# EasyEDA Pro project ProProject_gps打窝船_2025-04-29.epro, schematic Schematic1
Board Name: 船主控; Create Date: 2025-03-07; Page Name: P1; Project Name: gps打窝船; Schematic Name: Schematic1; Update Date: 2025-04-25; Company: 嘉立创EDA; Page Size: A4; Version: V1.0
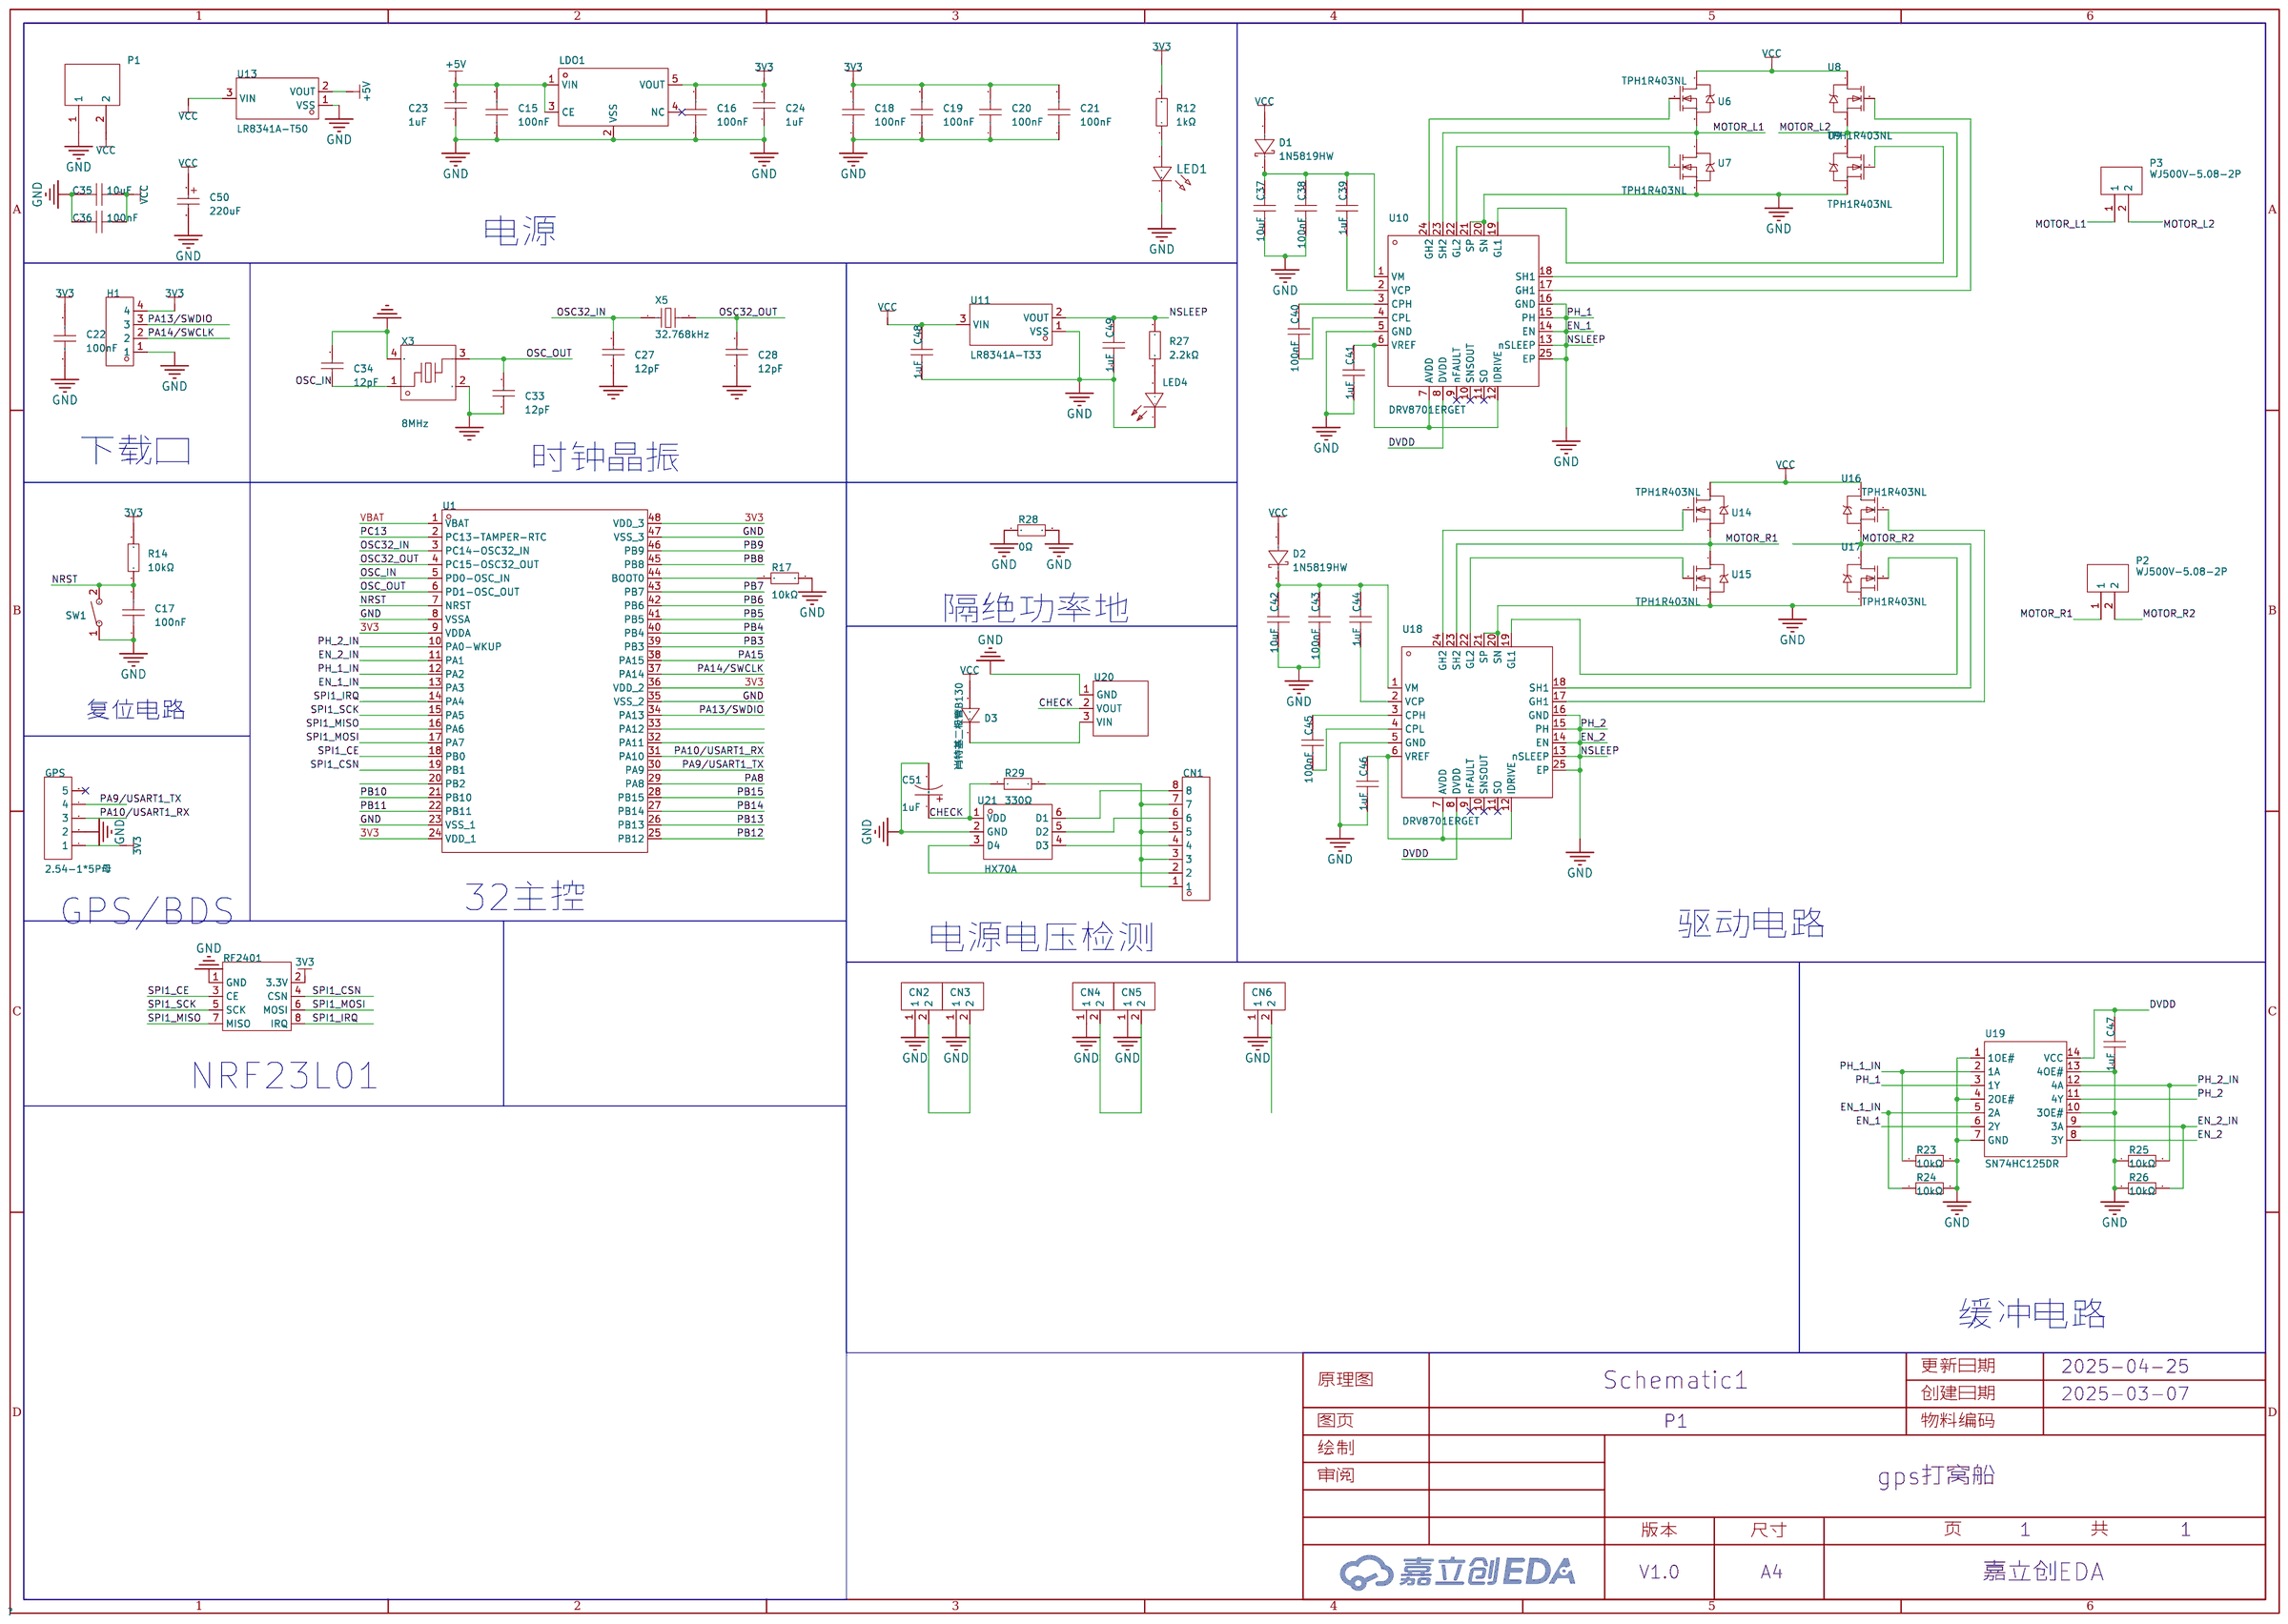
[diagram p1: schematic sheet]

## Parts
C15  100nF  [R0402]
C16  100nF  [R0402]
C17  100nF  [R0402]
C18  100nF  [R0402]
C19  100nF  [R0402]
C20  100nF  [R0402]
C21  100nF  [R0402]
C22  100nF  [R0402]
C23  1uF  [R0402]
C24  1uF  [R0402]
C27  12pF  [R0402]
C28  12pF  [R0402]
C33  12pF  [R0402]
C34  12pF  [R0402]
C35  10uF  [C0603]
C36  100nF  [C0603]
C37  10uF  [C0603]
C38  100nF  [C0603]
C39  1uF  [C0603]
C40  100nF  [C0603]
C41  1uF  [C0603]
C42  10uF  [C0603]
C43  100nF  [C0603]
C44  1uF  [C0603]
C45  100nF  [C0603]
C46  1uF  [C0603]
C47  1uF  [C0603]
C48  1uF  [C0603]
C49  1uF  [C0603]
C50  220uF  [CASE-B_3528]
C51  1uF  [CAP-SMD_L3.2-W1.6-RD]
CN1  ZX-XH2.54-8PZZ  [CONN-TH_8P-P2.50-XH2.54-8P]
CN2  ZX-XH2.54-2PZZ  [CONN-TH_2P-P2.50_HX25003-2A]
CN3  ZX-XH2.54-2PZZ  [CONN-TH_2P-P2.50_HX25003-2A]
CN4  ZX-XH2.54-2PZZ  [CONN-TH_2P-P2.50_HX25003-2A]
CN5  ZX-XH2.54-2PZZ  [CONN-TH_2P-P2.50_HX25003-2A]
CN6  ZX-XH2.54-2PZZ  [CONN-TH_2P-P2.50_HX25003-2A]
D1  1N5819HW  [SOD-123_L2.7-W1.6-LS3.8-RD]
D2  1N5819HW  [SOD-123_L2.7-W1.6-LS3.8-RD]
D3  肖特基二极管B130  [SOD-123_L2.7-W1.7-LS3.8-RD]
GPS  2.54-1*5P母  [HDR-TH_5P-P2.54-V-F]
H1  -  [HDR-TH_4P-P2.54-V-M]
LDO1  ME6211C33M5G-N  [SOT-23-5_L3.0-W1.7-P0.95-LS2.8-BL]
LED1  -  [LED_0603]
LED4  LTST-C191KSKT  [LED0603-RD-YELLOW]
P1  WJ128V-5.0-2P  [CONN-TH_2P-P5.00_WJ128V-5.0-2P]
P2  WJ500V-5.08-2P  [CONN-TH_2P-P5.00_WJ500V-5.08-2P]
P3  WJ500V-5.08-2P  [CONN-TH_2P-P5.00_WJ500V-5.08-2P]
R12  1kΩ  [R0402]
R14  10kΩ  [R0402]
R17  10kΩ  [R0402]
R23  10kΩ  [R0603]
R24  10kΩ  [R0603]
R25  10kΩ  [R0603]
R26  10kΩ  [R0603]
R27  2.2kΩ  [R0603]
R28  0Ω  [R0603]
R29  330Ω  [R0603]
RF2401  PZ254V-12-8P  [HDR-TH_8P-P2.54-V-M-R2-C4-S2.54]
SW1  TS-1101-B-W  [KEY-SMD_2P-L6.0-W3.6-P7.4-LS8.0-L]
U1  STM32F103C8T6  [LQFP-48_L7.0-W7.0-P0.50-LS9.0-BL]
U6  TPH1R403NL  [PDFN-8_L3.1-W3.0-P0.65-LS3.3-BL-G12P03D3]
U7  TPH1R403NL  [PDFN-8_L3.1-W3.0-P0.65-LS3.3-BL-G12P03D3]
U8  TPH1R403NL  [PDFN-8_L3.1-W3.0-P0.65-LS3.3-BL-G12P03D3]
U9  TPH1R403NL  [PDFN-8_L3.1-W3.0-P0.65-LS3.3-BL-G12P03D3]
U10  DRV8701ERGET  [VQFN-24_L4.0-W4.0-P0.50-BL-EP2.5]
U11  LR8341A-T33  [SOT-23-3L_L2.9-W1.6-P1.90-LS2.8-BL]
U13  LR8341A-T50  [SOT-23-3L_L2.9-W1.6-P1.90-LS2.8-BL]
U14  TPH1R403NL  [PDFN-8_L3.1-W3.0-P0.65-LS3.3-BL-G12P03D3]
U15  TPH1R403NL  [PDFN-8_L3.1-W3.0-P0.65-LS3.3-BL-G12P03D3]
U16  TPH1R403NL  [PDFN-8_L3.1-W3.0-P0.65-LS3.3-BL-G12P03D3]
U17  TPH1R403NL  [PDFN-8_L3.1-W3.0-P0.65-LS3.3-BL-G12P03D3]
U18  DRV8701ERGET  [VQFN-24_L4.0-W4.0-P0.50-BL-EP2.5]
U19  SN74HC125DR  [SOIC-14_L8.7-W3.9-P1.27-LS6.0-BL]
U20  MST52L30BTE  [SOT-23-3_L2.9-W1.6-P1.90-LS2.8-BR]
U21  HX70A  [SOT-23-6_L2.9-W1.6-P0.95-LS2.8-BL]
X3  8MHz  [CRYSTAL-SMD_4P-L3.2-W2.5-BL-1]
X5  32.768kHz  [OSC-SMD_L3.2-W1.5]

## Library data of the parts
C15-C22 = GRM155R71H104KE14D: 容值:100nF;精度:±10%;额定电压:50V;材质(温度系数):X7R;; LCSC Part Name: 100nF ±10% 50V; Supplier Part: C77020; Manufacturer: muRata(村田); Supplier Footprint: 0402; JLCPCB Part Class: 扩展库; Datasheet: https://atta.szlcsc.com/upload/public/pdf/source/20180326/C77020_39BD49C951FF1AF0DB1F1FAC5AC1E401.pdf; Supplier: LCSC; Tolerance: ±10%; Voltage Rated: 50V; Temperature Coefficient: X7R
C23 C24 = CL05A105KP5NNNC: 容值:1uF;精度:±10%;额定电压:10V;材质(温度系数):X5R;; LCSC Part Name: 1uF ±10% 10V; Supplier Part: C14445; Manufacturer: SAMSUNG(三星); Supplier Footprint: 0402; JLCPCB Part Class: 扩展库; Datasheet: https://atta.szlcsc.com/upload/public/pdf/source/20160218/1457707763339.pdf; Supplier: LCSC; Tolerance: ±10%; Voltage Rated: 10V; Temperature Coefficient: X5R
C27 C28 C33 C34 = 0402CG120J500NT: 容值:12pF;精度:±5%;额定电压:50V;材质(温度系数):C0G;; LCSC Part Name: 12pF ±5% 50V; Supplier Part: C1547; Manufacturer: FH(风华); Supplier Footprint: 0402; JLCPCB Part Class: 基础库; Datasheet: https://atta.szlcsc.com/upload/public/pdf/source/20200305/C486355_26A10D38EF8C2A5C37091D0039909270.pdf; Supplier: LCSC; Tolerance: ±5%; Voltage Rated: 50V; Temperature Coefficient: C0G
C35 C37 C42 = CGA0603X5R106K100JT: 容值:10uF;精度:±10%;额定电压:10V;温度系数:X5R;; LCSC Part Name: 10uF ±10% 10V; Supplier Part: C6119842; Manufacturer: HRE(芯声); Supplier Footprint: 0603; Supplier: LCSC; Tolerance: ±10%; Voltage Rating: 10V; Temperature Coefficient: X5R
C36 C38 C40 C43 C45 = CGA0603X7R104K500JT: 容值:100nF;精度:±10%;额定电压:50V;温度系数:X7R;; LCSC Part Name: 100nF ±10% 50V; Supplier Part: C6119867; Manufacturer: HRE(芯声); Supplier Footprint: 0603; Datasheet: https://atta.szlcsc.com/upload/public/pdf/source/20250103/C44077DA9E7B3EFAE02F22B6D3D1CBC9.pdf; Supplier: LCSC; Tolerance: ±10%; Voltage Rating: 50V; Temperature Coefficient: X7R
C39 C41 C44 C46-C49 = CGA0603X5R105K500JT: 容值:1uF;精度:±10%;额定电压:50V;温度系数:X5R;; LCSC Part Name: 1uF ±10% 50V; Supplier Part: C6119852; Manufacturer: HRE(芯声); Supplier Footprint: 0603; Supplier: LCSC; Tolerance: ±10%; Voltage Rating: 50V; Temperature Coefficient: X5R
C50 = TLJB227M006R0500: 容值:220uF;精度:±20%;额定电压:6.3V;等效串联电阻:500mΩ@100kHz;; LCSC Part Name: 220uF ±20% 6.3V; Supplier Part: C30242; Manufacturer: Kyocera AVX; Supplier Footprint: CASE-B-3528-21(mm); Datasheet: https://atta.szlcsc.com/upload/public/pdf/source/20181016/C313517_95E099C94D57B8A6005DAF15C3058A23.pdf; Supplier: LCSC; Tolerance: ±20%; Rated Voltage: 6.3V; Equivalent Series Resistance(ESR): 500mΩ@100kHz; Operating Temperature: -55℃~+125℃
C51 = CA45-A-16V-1uF-K: 容值:1uF;精度:±10%;额定电压:16V;等效串联电阻:10Ω@100kHz;; LCSC Part Name: 1uF ±10% 16V; Supplier Part: C140386; Manufacturer: CEC(振华新云); Supplier Footprint: CASE-A-3216; JLCPCB Part Class: 扩展库; Datasheet: https://atta.szlcsc.com/upload/public/pdf/source/20171113/C140386_15105612823691115749.pdf; Supplier: LCSC; Tolerance: ±10%; Rated Voltage: 16V; Equivalent Series Resistance(ESR): 10Ω@100kHz; Operating Temperature: -55℃~+125℃
CN1 = ZX-XH2.54-8PZZ: 插针结构:1x8P;间距:2.5mm;安装方式:直插;参考系列:XH;总PIN数:8P;排数:1;每排PIN数:8;行距:-;额定电流:3A;触头材质:黄铜;触头镀层:锡;工作温度范围:-25℃~+85℃;; LCSC Part Name: 1x8P 间距:2.5mm 直插 系列:XH; Supplier Part: C7429638; Manufacturer: Megastar(兆星); Supplier Footprint: 插件,P=2.5mm; Datasheet: https://atta.szlcsc.com/upload/public/pdf/source/20230619/688603DEA58996C00B1F33C46797D2C3.pdf; Supplier: LCSC; Pins Structure: 1x8P; Pitch: 2.5mm; Mounting Type: 直插; Reference Series: XH; Number of Pins: 8P; Number of Rows: 1; Number of PINs Per Row: 8; Rated Current: 3A; Contact Material: 黄铜; Contact Plating: 锡; Operating Temperature: -25℃~+85℃; Rated Voltage (Max): 250V; Plastic Material: PA66; Flame Retardant Rating: UL94V-0; Color: 白色; Z-Height of the Board: 7mm; X-Length of Bottom Edge on Board (Spacing Line): 22.5mm; Y-Width of Bottom Edge on Board: 5.9mm
CN2-CN6 = ZX-XH2.54-2PZZ: 插针结构:1x2P;间距:2.5mm;安装方式:直插;参考系列:XH;总PIN数:2P;排数:1;每排PIN数:2;行距:-;额定电流:3A;触头材质:黄铜;触头镀层:锡;工作温度范围:-25℃~+85℃;; LCSC Part Name: 1x2P 间距:2.5mm 直插 系列:XH; Supplier Part: C7429632; Manufacturer: Megastar(兆星); Supplier Footprint: 插件,P=2.5mm; Datasheet: https://atta.szlcsc.com/upload/public/pdf/source/20230619/19BA6947230AA44A04D3EDD65E618FD0.pdf; Supplier: LCSC; Pins Structure: 1x2P; Pitch: 2.5mm; Mounting Type: 直插; Reference Series: XH; Number of Pins: 2P; Number of Rows: 1; Number of PINs Per Row: 2; Rated Current: 3A; Contact Material: 黄铜; Contact Plating: 锡; Operating Temperature: -25℃~+85℃; Rated Voltage (Max): 250V; Plastic Material: PA66; Flame Retardant Rating: UL94V-0; Color: 白色; Z-Height of the Board: 7mm; X-Length of Bottom Edge on Board (Spacing Line): 7.5mm; Y-Width of Bottom Edge on Board: 5.9mm
D1 D2 = 1N5819HW_C41431974: 正向压降(Vf):580mV@1.0A;直流反向耐压(Vr):40V;整流电流:1A;; Supplier Part: C41431974; Manufacturer: GOODWORK(固得沃克); Supplier Footprint: SOD-123; Datasheet: https://atta.szlcsc.com/upload/public/pdf/source/20241016/F9575ED4EB339D9C6D56946D8A9F6336.pdf; Supplier: LCSC; Voltage - Forward(Vf@If): 580mV@1.0A; Voltage - DC Reverse(Vr): 40V; Current - Rectified: 1A; Reverse Leakage Current (Ir): 50uA@40V
D3 = 肖特基二极管B130: Supplier Part: C9900019643; Supplier Footprint: D1005; JLCPCB Part Class: 扩展库; Supplier: LCSC
GPS = 2.54-1*5P母: 插孔结构:1x5P;间距:2.54mm;行距:-;安装类型:直插;排数:单排;总孔位数:5P;塑高:-;触头材质:-;触头镀层:-;; LCSC Part Name: 间距:2.54mm 1x5P 直插; Supplier Part: C50950; Manufacturer: BOOMELE(博穆精密); Supplier Footprint: 插件,P=2.54mm; Datasheet: https://atta.szlcsc.com/upload/public/pdf/source/20210301/C2718488_F4427B881E42CAA8DDB0B1C12B3A522C.pdf; Supplier: LCSC; Holes Structure: 1x5P; Pitch: 2.54mm; Mounting Type: 直插; Number of Rows: 单排; Number of Holes: 5P
H1 = HDR-M_2.54_1x4P: Supplier Part: C2935929; Supplier Footprint: 插件
LDO1 = ME6211C33M5G-N: 输出类型:固定;工作电压:6V;输出电压:3.3V;输出电流:500mA;电源纹波抑制比(PSRR):70dB@(1kHz)；62dB@(10kHz);输出极性:正极;; LCSC Part Name: 输入6V 输出3.3V 500mA; Supplier Part: C82942; Manufacturer: MICRONE(南京微盟); Supplier Footprint: SOT-23-5; JLCPCB Part Class: 扩展库; Datasheet: https://atta.szlcsc.com/upload/public/pdf/source/20170918/C82942_1505727073070976520.pdf; Supplier: LCSC; Output Type: 固定; Voltage - Supply: 6V; Output Voltage: 3.3V; Output Current: 500mA; Power Supply Rejection Ratio (PSRR): 70dB@(1kHz)；62dB@(10kHz); Voltage Dropout: 260mV@(200mA); Features: 短路保护(SCP)；低ESR；过流保护(OCP)；带使能; Output Configuration: 正极; Number of Outputs: 1; Output Polarity: 正; Maximum Input Voltage: 6V; Dropout Voltage: 260mV@(200mA)
LED1 = LED_0603-R: Supplier Footprint: 0603; Supplier Part: C84263
LED4 = LTST-C191KSKT: 发光颜色:黄色;正向电压(VF):2.1V;功率:75mW;正向电流:20mA;主波长:584.5nm~597nm;二极管配置:-;透镜颜色:无色透明透镜;色温:-;发光强度:104mcd;发光角度:130°;载带方式:-;工作温度:-55℃~+85℃;; LCSC Part Name: 黄灯; Supplier Part: C125100; Manufacturer: LITEON(光宝); Supplier Footprint: 0603; Datasheet: https://atta.szlcsc.com/upload/public/pdf/source/20180129/C125100_15171877314981315871.pdf; Supplier: LCSC; Emitted Color: 黄色; Forward Voltage (VF): 2.1V; Power Dissipation: 75mW; Forward Current: 20mA; Dominant Wavelength: 584.5nm~597nm; Peak Wavelength: 588nm; Lens Color: 无色透明透镜; Luminous Intensity: 104mcd; Viewing Angle: 130°; Operating Temperature: -55℃~+85℃
P1 = WJ128V-5.0-2P: 结构:1x2P;间距:5mm;颜色:绿色;安装方式:直插;额定电流:20A;额定电压:250V;排数:1;线规 - AWG:12~22;线规 - 平方毫米:2.5;每排PIN数:2;工作温度范围:-40℃~+105℃;; LCSC Part Name: 5mm 1x2P 排数:1 每排P数:2 直插; Supplier Part: C8269; Manufacturer: KANGNEX(康奈克斯电气); Supplier Footprint: 插件,P=5mm; Datasheet: https://atta.szlcsc.com/upload/public/pdf/source/20191225/C8269_1FF44D6D2E83DB14A7CA266A410FD9AD.pdf; Supplier: LCSC; Structure: 1x2P; Pitch: 5mm; Color: 绿色; Mounting Style: 直插; Current Rating (Max): 20A; Voltage Rating (Max): 250V; Number of Pins: 2P; Number of Rows: 1; Wire Gauge - AWG: 12~22; Wire Gauge - mm2: 2.5; Number of PINs Per Row: 2; Operating Temperature Range: -40℃~+105℃
P2 P3 = WJ500V-5.08-2P: 结构:1x2P;间距:5.08mm;颜色:绿色;安装方式:直插;额定电流:18A;额定电压:250V;排数:1;线规 - AWG:14~30;线规 - 平方毫米:2.5;每排PIN数:2;触头材质:-;触头镀层:-;工作温度范围:-40℃~+105℃;焊接温度(最大值):-;; LCSC Part Name: 1x2P 5.08mm 直插 排数:1 每排P数:2; Supplier Part: C8465; Manufacturer: KANGNEX(康奈克斯电气); Supplier Footprint: 插件,P=5.08mm; Datasheet: https://atta.szlcsc.com/upload/public/pdf/source/20191225/C8465_02D34CE5B5B4A53DF5891601D97FA9F4.pdf; Supplier: LCSC; Structure: 1x2P; Pitch: 5.08mm; Color: 绿色; Mounting Style: 直插; Current Rating (Max): 18A; Voltage Rating (Max): 250V; Number of Pins: 2P; Number of Rows: 1; Wire Gauge - AWG: 14~30; Wire Gauge - mm2: 2.5; Number of PINs Per Row: 2; Operating Temperature Range: -40℃~+105℃; Screw Specification: M2.5
R12 = 0402WGF1001TCE: 电阻类型:厚膜电阻;阻值:1kΩ;精度:±1%;功率:62.5mW;最大工作电压:50V;温度系数:±100ppm/℃;; LCSC Part Name: 1kΩ ±1% 62.5mW 厚膜电阻; Supplier Part: C11702; Manufacturer: UNI-ROYAL(厚声); Supplier Footprint: 0402; JLCPCB Part Class: 基础库; Datasheet: https://atta.szlcsc.com/upload/public/pdf/source/20200306/C422600_1E6D84923E4A46A82E41ADD87F860B5C.pdf; Supplier: LCSC; Type: 厚膜电阻; Tolerance: ±1%; Power(Watts): 62.5mW; Overload Voltage (Max): 50V; Temperature Coefficient: ±100ppm/℃; Operating Temperature Range: -55℃~+155℃
R14 R17 = RC0402FR-0710KL: 电阻类型:厚膜电阻;阻值:10kΩ;精度:±1%;功率:62.5mW;最大工作电压:50V;温度系数:±100ppm/℃;; LCSC Part Name: 厚膜电阻 10kΩ ±1% 62.5mW; Supplier Part: C60490; Manufacturer: YAGEO(国巨); Supplier Footprint: 0402; JLCPCB Part Class: 扩展库; Datasheet: https://atta.szlcsc.com/upload/public/pdf/source/20170925/C131467_1506321478108990263.pdf; Supplier: LCSC; Type: 厚膜电阻; Tolerance: ±1%; Power(Watts): 62.5mW; Overload Voltage (Max): 50V; Temperature Coefficient: ±100ppm/℃; Operating Temperature Range: -55℃~+155℃
R23-R26 = 0603WAF1002T5E: 电阻类型:厚膜电阻;阻值:10kΩ;精度:±1%;功率:100mW;最大工作电压:75V;温度系数:±100ppm/℃;; LCSC Part Name: 厚膜电阻 10kΩ ±1% 100mW; Supplier Part: C25804; Manufacturer: UNI-ROYAL(厚声); Supplier Footprint: 0603; Datasheet: https://atta.szlcsc.com/upload/public/pdf/source/20200306/C422600_1E6D84923E4A46A82E41ADD87F860B5C.pdf; Supplier: LCSC; Type: 厚膜电阻; Tolerance: ±1%; Power(Watts): 100mW; Overload Voltage (Max): 75V; Temperature Coefficient: ±100ppm/℃; Operating Temperature Range: -55℃~+155℃
R27 = 0603WAF2201T5E: 电阻类型:厚膜电阻;阻值:2.2kΩ;精度:±1%;功率:100mW;最大工作电压:75V;温度系数:±100ppm/℃;; LCSC Part Name: 2.2kΩ ±1% 100mW 厚膜电阻; Supplier Part: C4190; Manufacturer: UNI-ROYAL(厚声); Supplier Footprint: 0603; Datasheet: https://atta.szlcsc.com/upload/public/pdf/source/20200306/C422600_1E6D84923E4A46A82E41ADD87F860B5C.pdf; Supplier: LCSC; Type: 厚膜电阻; Tolerance: ±1%; Power(Watts): 100mW; Overload Voltage (Max): 75V; Temperature Coefficient: ±100ppm/℃; Operating Temperature Range: -55℃~+155℃
R28 = 0603WAF0000T5E: 电阻类型:厚膜电阻;阻值:0Ω;精度:±1%;功率:100mW;最大工作电压:75V;; LCSC Part Name: 0Ω ±1% 100mW 厚膜电阻; Supplier Part: C21189; Manufacturer: UNI-ROYAL(厚声); Supplier Footprint: 0603; Datasheet: https://atta.szlcsc.com/upload/public/pdf/source/20200306/C422600_1E6D84923E4A46A82E41ADD87F860B5C.pdf; Supplier: LCSC; Type: 厚膜电阻; Tolerance: ±1%; Power(Watts): 100mW; Overload Voltage (Max): 75V; Operating Temperature Range: -55℃~+155℃
R29 = 0603WAF3300T5E: 电阻类型:厚膜电阻;阻值:330Ω;精度:±1%;功率:100mW;最大工作电压:75V;温度系数:±100ppm/℃;; LCSC Part Name: 330Ω ±1% 100mW 厚膜电阻; Supplier Part: C23138; Manufacturer: UNI-ROYAL(厚声); Supplier Footprint: 0603; JLCPCB Part Class: 基础库; Datasheet: https://atta.szlcsc.com/upload/public/pdf/source/20200306/C422600_1E6D84923E4A46A82E41ADD87F860B5C.pdf; Supplier: LCSC; Type: 厚膜电阻; Tolerance: ±1%; Power(Watts): 100mW; Overload Voltage (Max): 75V; Temperature Coefficient: ±100ppm/℃; Operating Temperature Range: -55℃~+155℃
RF2401 = PZ254V-12-8P: 插针结构:2x4P;间距:2.54mm;行距:2.54mm;圆针/方针:方针;安装方式:直插;排数:双排;总PIN位数:8P;额定电流:-;额定电压:-;配合针长度:6mm;塑高:2.5mm;端接针长度:3mm;触头材质:黄铜;触头镀层:-;工作温度:-40℃~+105℃;颜色:黑色;; LCSC Part Name: 2x4P 间距:2.54mm 方针 直插; Supplier Part: C492421; Manufacturer: XFCN(兴飞); Supplier Footprint: 插件,P=2.54mm; Datasheet: https://atta.szlcsc.com/upload/public/pdf/source/20200309/C492421_DC8A206AF99CD7755BD4A5B0BC48200B.pdf; Supplier: LCSC; Pin Structure: 2x4P; Pitch: 2.54mm; Row Spacing: 2.54mm; Circluar Pins/Square Pins: 方针; Mounting Type: 直插; Number of Rows: 双排; Number of Pins: 8P; Length of Mating Pin: 6mm; Insulation Height: 2.5mm; Length of End Connection Pin: 3mm; Contact Material: 黄铜; Operating Temperature: -40℃~+105℃; Color: 黑色
SW1 = TS-1101-B-W_C500065: 触点电流:50mA;额定电压(DC):12V;绝缘电阻:-;电路结构:单刀单掷;安装方式:立贴;带灯:无;作用力:160gf;机械寿命:5万次;带支架:否;; LCSC Part Name: 6*3.6*2.5mm 立贴 轻触开关; Supplier Part: C500065; Manufacturer: XKB Connectivity(中国星坤); Supplier Footprint: SMD; JLCPCB Part Class: 扩展库; Datasheet: https://atta.szlcsc.com/upload/public/pdf/source/20211011/D0E0CAF534F7B19DDE4CE68748A25BD3.pdf; Supplier: LCSC; Contact Current: 50mA; Voltage Rating (DC): 12V; Circuit: 单刀单掷; Mounting Style: 立贴; Actuator Style: 矩形按钮; Actuator/Cap Color: 白色; With Lamp: 无; Operating Force: 160gf; Mechanical Life: 5万次; Operating Temperature: -30℃~+85℃; Switch Length: 6mm; Switch Width: 3.6mm; Switch Height: 2.5mm; Strike Gundam: 否
U1 = STM32F103C8T6: CPU内核:ARM-M3;CPU最大主频:72MHz;应用领域:-;; LCSC Part Name: 主流增强型ARM Cortex-M3 MCU，具有64 KB Flash、72 MHz CPU、电机控制、USB和CAN; Supplier Part: C8734; Manufacturer: ST(意法半导体); Supplier Footprint: LQFP-48(7x7); JLCPCB Part Class: 扩展库; Datasheet: https://atta.szlcsc.com/upload/public/pdf/source/20220812/8363ACEC51AD55ECEB84799464F7CB85.pdf; Supplier: LCSC; CPU Core: ARM-M3; CPU Maximum Speed: 72MHz; Program Storage Size: 64KB; Program Memory Type: FLASH; Number of I/O: 37; ADC (Bit): 12bit; Low Voltage Detection Threshold: 2V~3.6V; RAM Size: 20KB; GPIO Ports Number: 37; Operating Voltage Range: 2V~3.6V; Operating Temperature Range: -40℃~+85℃; Universal Serial Bus: 有; Peripheral/Function: 看门狗；DMA；看门狗；片载温度传感器; Watchdog: 有; Infrared Data Association: 有; Low-Voltage Detect: 有; Direct Memory Access: 有; Internal Oscillator: 有
U6-U9 U14-U17 = TPH1R403NL: Supplier Part: C9900016373; Supplier Footprint: DFN-8-EP(5x5); JLCPCB Part Class: 扩展库; Supplier: LCSC
U10 U18 = DRV8701ERGET: DRV8701 47V H 桥智能栅极驱动器; LCSC Part Name: 有刷直流电机驱动芯片 5.5V; Supplier Part: C132049; Manufacturer: TI(德州仪器); Supplier Footprint: VQFN-24(4x4); Datasheet: https://www.ti.com/cn/lit/gpn/drv8701; Supplier: LCSC
U11 = LR8341A-T33: 输出类型:固定;最大输入电压:40V;输出电压:3.3V;最大输出电流:100mA;电源纹波抑制比(PSRR):55dB@(1kHz);输出极性:正极;; LCSC Part Name: 输入40V 输出3.3V 100mA; Supplier Part: C2829465; Manufacturer: LR(朗瑞); Supplier Footprint: SOT-23-3L; Datasheet: https://atta.szlcsc.com/upload/public/pdf/source/20210426/C2829465_61F15D7ACE9671B48D4F69A8092B0D8F.pdf; Supplier: LCSC; Output Type: 固定; Maximum Input Voltage: 40V; Output Voltage: 3.3V; MAX Output Current: 100mA; Power Supply Rejection Ratio (PSRR): 55dB@(1kHz); standby current: 2uA; Operating Temperature: -40℃~+85℃; Output Polarity: 正极; Number of Outputs: 1
U13 = LR8341A-T50: 输出类型:固定;最大输入电压:40V;输出电压:5V;最大输出电流:100mA;电源纹波抑制比(PSRR):55dB@(1kHz);输出极性:正极;; LCSC Part Name: 输入40V 输出5V 100mA; Supplier Part: C2829466; Manufacturer: LR(朗瑞); Supplier Footprint: SOT-23-3L; Datasheet: https://atta.szlcsc.com/upload/public/pdf/source/20210426/C2829466_E884E1CCC71E84020972355DCEF57C58.pdf; Supplier: LCSC; Output Type: 固定; Maximum Input Voltage: 40V; Output Voltage: 5V; MAX Output Current: 100mA; Power Supply Rejection Ratio (PSRR): 55dB@(1kHz); standby current: 2uA; Operating Temperature: -40℃~+85℃; Output Polarity: 正极; Number of Outputs: 1
U19 = SN74HC125DR: 输入类型:-;工作电压:2V~6V;元件数:4;每个元件位数:1;灌电流(IOL):7.8mA;拉电流(IOH):7.8mA;; Supplier Part: C42322; Manufacturer: TI(德州仪器); Supplier Footprint: SOIC-14; Datasheet: https://www.ti.com/cn/lit/gpn/sn74hc125; Supplier: LCSC; output type: 三态; Voltage - Supply: 2V~6V; Number of Elements: 4; Number of Bits per Element: 1; Current - Output Low(IOL): 7.8mA; Current - Output High(IOH): 7.8mA; Logic Family: 74HC; Operating Temperature: -40℃~+85℃
U20 = MST52L30BTE: 输出类型:固定;工作电压:24V;输出电压:3V;输出电流:150mA;电源纹波抑制比(PSRR):-;输出极性:正极;; Supplier Part: C2761427; Manufacturer: MST(迈尔斯通); Supplier Footprint: SOT-23; JLCPCB Part Class: 扩展库; Datasheet: https://atta.szlcsc.com/upload/public/pdf/source/20210318/C2761419_E8DAF931CF8151264C7E11857EEB9B64.pdf; Supplier: LCSC; Output Type: 固定; Voltage - Supply: 24V; Output Voltage: 3V; Output Current: 150mA; Features: 防静电保护；短路保护(SCP); Operating Temperature: -20℃~+70℃; Output Configuration: 正极; Number of Outputs: 1
U21 = HX70A: Supplier Part: C2846626; Supplier Footprint: SOT-23-6; JLCPCB Part Class: 扩展库; Supplier: LCSC
X3 = XL2EL89COI-111YLC-8M: 晶振类型:贴片晶振;频率:8MHz;常温频差:±10ppm;外接负载电容:12pF;频率稳定度(全温):±20ppm;; LCSC Part Name: 8MHz ±10ppm 12pF; Supplier Part: C2973805; Manufacturer: YXC(扬兴晶振); Supplier Footprint: SMD3225-4P; JLCPCB Part Class: 扩展库; Datasheet: https://atta.szlcsc.com/upload/public/pdf/source/20240329/19D5F850207469550BEB00D7DFEDBC7A.pdf; Supplier: LCSC; Crystal Type: 贴片晶振; Normal temperature Frequency Tolerance: ±10ppm; External load capacitor: 12pF; Frequency Stability(Full temperature range): ±20ppm; Equivalent Series Resistance (ESR): 150Ω; Operating Temperature: -40℃~+85℃
X5 = X321532768KGD2SI: 晶振类型:贴片晶振;频率:32.768kHz;常温频差:±20ppm;外接负载电容:12.5pF;频率稳定度(全温):-;; LCSC Part Name: 32.768kHz ±20ppm 12.5pF; Supplier Part: C620155; Manufacturer: YXC(扬兴晶振); Supplier Footprint: SMD3215-2P; JLCPCB Part Class: 扩展库; Datasheet: https://atta.szlcsc.com/upload/public/pdf/source/20240329/3A7650FD985DD0DE85694D3785AB4916.pdf; Supplier: LCSC; Crystal Type: 贴片晶振; Normal temperature Frequency Tolerance: ±20ppm; External load capacitor: 12.5pF; Operating Temperature: -40℃~+85℃

## Nets
3V3: C16.2 C18.2 C19.2 C20.2 C21.2 C22.2 C24.2 GPS.1 H1.4 LDO1.5(VOUT) R12.2 R14.2 RF2401.2(3.3V) U1.9(VDDA) U1.24(VDD_1) U1.36(VDD_2) U1.48(VDD_3)
+5V: C15.2 C23.2 LDO1.1(VIN) LDO1.3(CE) U13.2(VOUT)
DVDD: C47.2 U10.8(DVDD) U18.8(DVDD) U19.14(VCC)
GND: C15.1 C16.1 C17.1 C18.1 C19.1 C20.1 C21.1 C22.1 C23.1 C24.1 C27.1 C28.1 C33.1 C34.2 C35.1 C36.1 C37.1 C38.1 C41.1 C42.1 C43.1 C46.1 C47.1 C48.1 C49.1 C50.2 C51.2 CN2.1 CN3.1 CN4.1 CN5.1 CN6.1 GPS.2 H1.1 LDO1.2(VSS) LED1.1(C) LED4.1(-) P1.1 R17.1 R23.2 R24.2 R25.1 R26.1 R28.1 R28.2 RF2401.1(GND) SW1.1 U1.8(VSSA) U1.23(VSS_1) U1.35(VSS_2) U1.47(VSS_3) U7.3(S) U9.3(S) U10.5(GND) U10.16(GND) U10.20(SN) U10.21(SP) U10.25(EP) U11.1(VSS) U13.1(VSS) U15.3(S) U17.3(S) U18.5(GND) U18.16(GND) U18.20(SN) U18.21(SP) U18.25(EP) U19.1(1OE#) U19.4(2OE#) U19.7(GND) U19.10(3OE#) U19.13(4OE#) U20.1(GND) U21.2(GND) X3.2(GND) X3.4(GND)
VBAT: U1.1(VBAT)
VCC: C35.2 C36.2 C48.2 C50.1 D1.2(A) D2.2(A) D3.2(A) P1.2 U6.1(D) U8.1(D) U11.3(VIN) U13.3(VIN) U14.1(D) U16.1(D)
CHECK: C51.1 R29.1 U20.2(VOUT) U21.1(VDD)
EN_1: U10.14(EN) U19.6(2Y)
EN_1_IN: R24.1 U1.13(PA3) U19.5(2A)
EN_2: U18.14(EN) U19.8(3Y)
EN_2_IN: R26.2 U1.11(PA1) U19.9(3A)
MOTOR_L1: P3.1 U6.3(S) U7.1(D) U10.23(SH2)
MOTOR_L2: P3.2 U8.3(S) U9.1(D) U10.18(SH1)
MOTOR_R1: P2.1 U14.3(S) U15.1(D) U18.23(SH2)
MOTOR_R2: P2.2 U16.3(S) U17.1(D) U18.18(SH1)
NRST: C17.2 R14.1 SW1.2 U1.7(NRST)
NSLEEP: C49.2 R27.2 U10.13(nSLEEP) U11.2(VOUT) U18.13(nSLEEP)
OSC32_IN: C27.2 U1.3(PC14-OSC32_IN) X5.1
OSC32_OUT: C28.2 U1.4(PC15-OSC32_OUT) X5.2
OSC_IN: C34.1 U1.5(PD0-OSC_IN) X3.1
OSC_OUT: C33.2 U1.6(PD1-OSC_OUT) X3.3
PA8: U1.29(PA8)
PA9/USART1_TX: GPS.4 U1.30(PA9)
PA10/USART1_RX: GPS.3 U1.31(PA10)
PA13/SWDIO: H1.3 U1.34(PA13)
PA14/SWCLK: H1.2 U1.37(PA14)
PA15: U1.38(PA15)
PB3: U1.39(PB3)
PB4: U1.40(PB4)
PB5: U1.41(PB5)
PB6: U1.42(PB6)
PB7: U1.43(PB7)
PB8: U1.45(PB8)
PB9: U1.46(PB9)
PB10: U1.21(PB10)
PB11: U1.22(PB11)
PB12: U1.25(PB12)
PB13: U1.26(PB13)
PB14: U1.27(PB14)
PB15: U1.28(PB15)
PC13: U1.2(PC13-TAMPER-RTC)
PH_1: U10.15(PH) U19.3(1Y)
PH_1_IN: R23.1 U1.12(PA2) U19.2(1A)
PH_2: U18.15(PH) U19.11(4Y)
PH_2_IN: R25.2 U1.10(PA0-WKUP) U19.12(4A)
SPI1_CE: RF2401.3(CE) U1.18(PB0)
SPI1_CSN: RF2401.4(CSN) U1.19(PB1)
SPI1_IRQ: RF2401.8(IRQ) U1.14(PA4)
SPI1_MISO: RF2401.7(MISO) U1.16(PA6)
SPI1_MOSI: RF2401.6(MOSI) U1.17(PA7)
SPI1_SCK: RF2401.5(SCK) U1.15(PA5)
$1N9675: LED1.2(A) R12.1
$1N11282: R17.2 U1.44(BOOT0)
$1N20842: C37.2 C38.2 C39.2 D1.1(C) U10.1(VM)
$1N20851: C39.1 U10.2(VCP)
$1N20889: C40.2 U10.3(CPH)
$1N20892: C40.1 U10.4(CPL)
$1N21047: C41.2 U10.6(VREF) U10.7(AVDD) U10.12(IDRIVE)
$1N21116: U8.2(G) U10.17(GH1)
$1N21181: U9.2(G) U10.19(GL1)
$1N21232: U7.2(G) U10.22(GL2)
$1N21252: U6.2(G) U10.24(GH2)
$1N21827: C42.2 C43.2 C44.2 D2.1(C) U18.1(VM)
$1N21835: C44.1 U18.2(VCP)
$1N21838: C45.2 U18.3(CPH)
$1N21840: C45.1 U18.4(CPL)
$1N21849: C46.2 U18.6(VREF) U18.7(AVDD) U18.12(IDRIVE)
$1N21874: U16.2(G) U18.17(GH1)
$1N21879: U17.2(G) U18.19(GL1)
$1N21893: U15.2(G) U18.22(GL2)
$1N21897: U14.2(G) U18.24(GH2)
$1N22854: LED4.2(+) R27.1
$1N29114: D3.1(C) U20.3(VIN)
$1N31681: CN1.8 U21.6(D1)
$1N31692: CN1.2 U21.3(D4)
$1N31699: CN1.6 U21.5(D2)
$1N31708: CN1.4 U21.4(D3)
$1N31797: CN1.1 CN1.3 CN1.5 CN1.7 R29.2
Net-(CN2-2): CN2.2 CN3.2
Net-(CN4-2): CN4.2 CN5.2

Not connected (* = marked no-connect by the designer): CN6 2; GPS 5*; LDO1 4(NC)*; U1 20(PB2) 32(PA11) 33(PA12); U10 9(nFAULT)* 10(SNSOUT)* 11(SO)*; U18 9(nFAULT)* 10(SNSOUT)* 11(SO)*

## Notes on the sheet
- 电源
- 下载口
- 时钟晶振
- 隔绝功率地
- 复位电路
- 32主控
- GPS/BDS
- 电源电压检测
- 驱动电路
- NRF23L01
- 缓冲电路
